# Altium project Projekat.PrjPcb
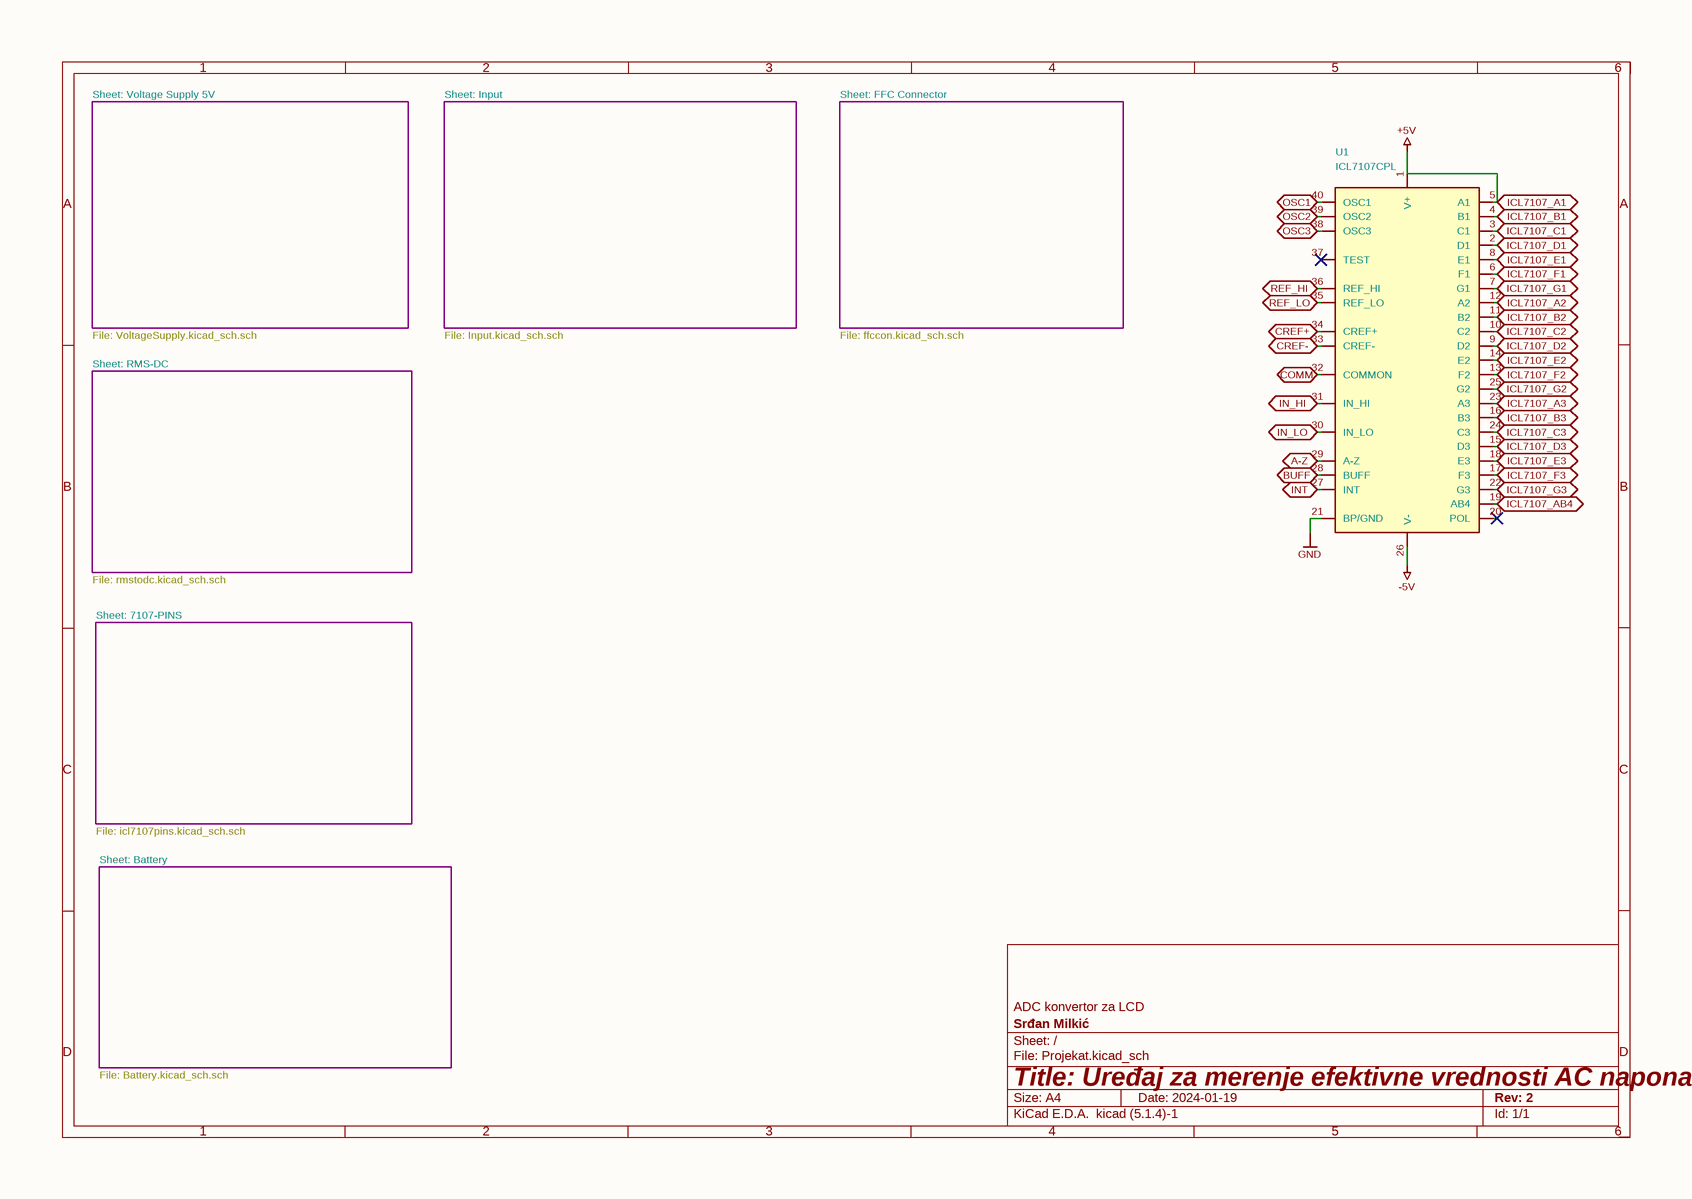
[diagram p0: Projekat.SchDoc]
7 sheets, 60 parts. Net scope: flat (ports and power ports of the same name join across sheets).
Board file: Projekat.PcbDoc
Sheets:
  Projekat.SchDoc
    Input = Input.SchDoc
    7107-PINS = icl7107pins.SchDoc
    Battery = Battery.SchDoc
    RMS-DC = rmstodc.SchDoc
    Voltage Supply 5V = VoltageSupply.SchDoc
    FFC Connector = ffccon.SchDoc

## Sheet Projekat.SchDoc
size 297 x 209 mm

### Parts
U1  ICL7107CPL  [DIP-40_W15.24mm]

### Sub-sheets
7107-PINS = icl7107pins.SchDoc: no entries
Battery = Battery.SchDoc: no entries
FFC Connector = ffccon.SchDoc: no entries
Input = Input.SchDoc: no entries
RMS-DC = rmstodc.SchDoc: no entries
Voltage Supply 5V = VoltageSupply.SchDoc: no entries

### Ports
A-Z (bidir), BUFF (bidir), COMM (bidir), CREF+ (bidir), CREF- (bidir), ICL7107_A1 (bidir), ICL7107_A2 (bidir), ICL7107_A3 (bidir), ICL7107_AB4 (bidir), ICL7107_B1 (bidir), ICL7107_B2 (bidir), ICL7107_B3 (bidir), ICL7107_C1 (bidir), ICL7107_C2 (bidir), ICL7107_C3 (bidir), ICL7107_D1 (bidir), ICL7107_D2 (bidir), ICL7107_D3 (bidir), ICL7107_E1 (bidir), ICL7107_E2 (bidir), ICL7107_E3 (bidir), ICL7107_F1 (bidir), ICL7107_F2 (bidir), ICL7107_F3 (bidir), ICL7107_G1 (bidir), ICL7107_G2 (bidir), ICL7107_G3 (bidir), IN_HI (bidir), IN_LO (bidir), INT (bidir), OSC1 (bidir), OSC2 (bidir), OSC3 (bidir), REF_HI (bidir), REF_LO (bidir)

### Nets
+5V: U1.1(V+) U1.5(A1) ; port ICL7107_A1
-5V: U1.21(BP/GND) U1.26(V-)  [also labelled GND]
A-Z: U1.29(A-Z) ; port A-Z
AD737_COM: U1.30(IN_LO) U1.32(COMMON) U1.35(REF_LO) ; port COMM, port REF_LO, port IN_LO
BUFF: U1.28(BUFF) ; port BUFF
CREF+: U1.34(CREF+) ; port CREF+
CREF-: U1.33(CREF-) ; port CREF-
ICL7107_A2: U1.12(A2) ; port ICL7107_A2
ICL7107_A3: U1.23(A3) ; port ICL7107_A3
ICL7107_AB4: U1.19(AB4) ; port ICL7107_AB4
ICL7107_B1: U1.4(B1) ; port ICL7107_B1
ICL7107_B2: U1.11(B2) ; port ICL7107_B2
ICL7107_B3: U1.16(B3) ; port ICL7107_B3
ICL7107_C1: U1.3(C1) ; port ICL7107_C1
ICL7107_C2: U1.10(C2) ; port ICL7107_C2
ICL7107_C3: U1.24(C3) ; port ICL7107_C3
ICL7107_D1: U1.2(D1) ; port ICL7107_D1
ICL7107_D2: U1.9(D2) ; port ICL7107_D2
ICL7107_D3: U1.15(D3) ; port ICL7107_D3
ICL7107_E1: U1.8(E1) ; port ICL7107_E1
ICL7107_E2: U1.14(E2) ; port ICL7107_E2
ICL7107_E3: U1.18(E3) ; port ICL7107_E3
ICL7107_F1: U1.6(F1) ; port ICL7107_F1
ICL7107_F2: U1.13(F2) ; port ICL7107_F2
ICL7107_F3: U1.17(F3) ; port ICL7107_F3
ICL7107_G1: U1.7(G1) ; port ICL7107_G1
ICL7107_G2: U1.25(G2) ; port ICL7107_G2
ICL7107_G3: U1.22(G3) ; port ICL7107_G3
IN_HI: U1.31(IN_HI) ; port IN_HI
INT: U1.27(INT) ; port INT
OSC1: U1.40(OSC1) ; port OSC1
OSC2: U1.39(OSC2) ; port OSC2
OSC3: U1.38(OSC3) ; port OSC3
REF_HI: U1.36(REF_HI) ; port REF_HI

Not connected (* = marked no-connect by the designer): U1 20(POL)* 37(TEST)*

### Notes on the sheet
- Sheet: Voltage Supply 5V
- Sheet: Input
- Sheet: FFC Connector
- File: VoltageSupply.kicad_sch.sch
- File: Input.kicad_sch.sch
- File: ffccon.kicad_sch.sch
- Sheet: RMS-DC
- File: rmstodc.kicad_sch.sch
- Sheet: 7107-PINS
- File: icl7107pins.kicad_sch.sch
- Sheet: Battery
- File: Battery.kicad_sch.sch
- 1
- 2
- 3
- 4
- 5
- 6
- A
- B
- C
- ADC konvertor za LCD
- D
- Title: Uređaj za merenje efektivne vrednosti AC napona
- File: Projekat.kicad_sch
- Sheet: /
- Srđan Milkić
- KiCad E.D.A.  kicad (5.1.4)-1
- Size: A4
- Date: 2024-01-19
- Rev: 2
- Id: 1/1

### Library data of the parts
U1 = ICL7107CPL: Value: ICL7107CPL; Footprint: Package_DIP:DIP-40_W15.24mm

## Sheet Input.SchDoc
size 297 x 209 mm
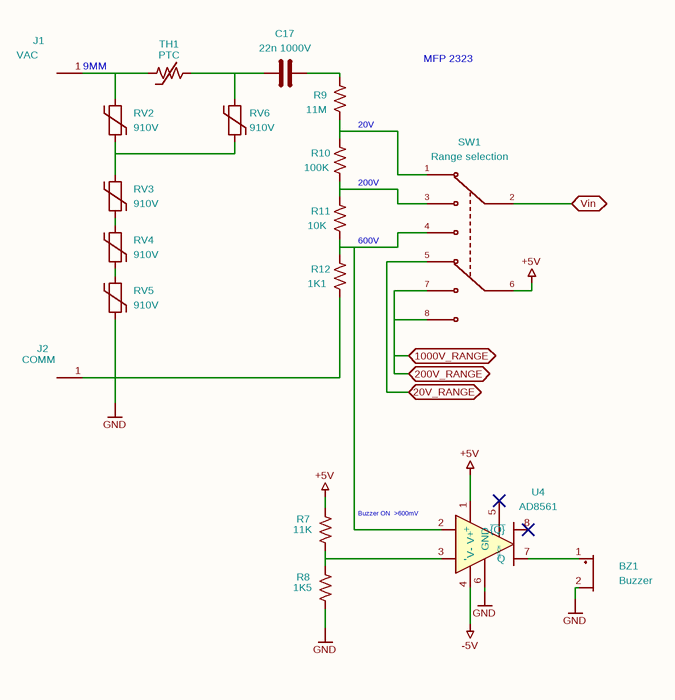
[diagram p1: Input.SchDoc]

### Parts
BZ1  Buzzer  [Buzzer_12x9.5RM7.6]
C17  22n 1000V  [C_Rect_L26.5mm_W11.5mm_P22.50mm_MKS4]
J1  VAC  [Banana_Jack_1Pin]
J2  COMM  [Banana_Jack_1Pin]
R7  11K  [R_1206_3216Metric]
R8  1K5  [R_1206_3216Metric]
R9  11M  [R_1210_3225Metric]
R10  100K  [R_1206_3216Metric]
R11  10K  [R_1206_3216Metric]
R12  1K1  [R_1206_3216Metric]
RV2  910V  [RV_Disc_D12mm_W3.9mm_P7.5mm]
RV3  910V  [RV_Disc_D12mm_W3.9mm_P7.5mm]
RV4  910V  [RV_Disc_D12mm_W3.9mm_P7.5mm]
RV5  910V  [RV_Disc_D12mm_W3.9mm_P7.5mm]
RV6  910V  [RV_Disc_D12mm_W3.9mm_P7.5mm]
SW1  Range selection  [SW_EG2310]
TH1  PTC  [R_Axial_DIN0414_L11.9mm_D4.5mm_P7.62mm_Vertical]
U4  AD8561  [DIP-8_W7.62mm]

### Ports
20V_RANGE (bidir), 200V_RANGE (bidir), 1000V_RANGE (bidir), Vin (bidir)

### Nets
+5V: R7.1 SW1.6 U4.1(V+)
-5V: BZ1.2(+) J2.1(Pin_1) R8.2 R12.2 RV5.2 U4.4(V-) U4.6(GND)  [also labelled GND]
20V_RANGE: SW1.5 ; port 20V_RANGE
1000V_RANGE: SW1.7 SW1.8 ; port 200V_RANGE, port 1000V_RANGE
Vin: SW1.2 ; port Vin
NetBZ1_1: BZ1.1(-) U4.7(Q)
NetC17_1: C17.1 RV6.1 TH1.2
NetC17_2: C17.2 R9.2
NetJ1_1: J1.1(Pin_1) RV2.1 TH1.1
NetR7_2: R7.2 R8.1 U4.3(-)
NetR9_1: R9.1 R10.1 SW1.1
NetR10_2: R10.2 R11.1 SW1.3
NetR11_2: R11.2 R12.1 SW1.4 U4.2(+)
NetRV2_2: RV2.2 RV3.1 RV6.2
NetRV3_2: RV3.2 RV4.1
NetRV4_2: RV4.2 RV5.1

Not connected (* = marked no-connect by the designer): U4 5(LATCH)* 8(~{{Q}})*

### Notes on the sheet
- 9MM
- MFP 2323
- 20V
- 200V
- 600V
- Buzzer ON  >600mV
- 1
- 2
- 3
- 4
- 5
- 6
- A
- B
- C
- D
- Title: Uređaj za merenje efektivne vrednosti AC napona
- File: Input.kicad_sch
- Sheet: /
- Srđan Milkić
- KiCad E.D.A.  kicad (5.1.4)-1
- Size: A4
- Date: 2024-01-19
- Rev: 2
- Id: 1/1

### Library data of the parts
C17 = C: Value: 22n 1000V; Footprint: Capacitor_THT:C_Rect_L26.5mm_W11.5mm_P22.50mm_MKS4
J1 J2 = Conn_01x01_Female: Footprint: Connector:Banana_Jack_1Pin
  J1: Value: VAC
  J2: Value: COMM
R7-R12 = R_US
  R7: Value: 11K; Footprint: Resistor_SMD:R_1206_3216Metric
  R8: Value: 1K5; Footprint: Resistor_SMD:R_1206_3216Metric
  R9: Value: 11M; Footprint: Resistor_SMD:R_1210_3225Metric
  R10: Value: 100K; Footprint: Resistor_SMD:R_1206_3216Metric
  R11: Value: 10K; Footprint: Resistor_SMD:R_1206_3216Metric
  R12: Value: 1K1; Footprint: Resistor_SMD:R_1206_3216Metric
RV2 = Varistor_1: Value: 910V; Footprint: Varistor:RV_Disc_D12mm_W3.9mm_P7.5mm
RV3 = Varistor_2: Value: 910V; Footprint: Varistor:RV_Disc_D12mm_W3.9mm_P7.5mm
RV4 = Varistor_3: Value: 910V; Footprint: Varistor:RV_Disc_D12mm_W3.9mm_P7.5mm
RV5 = Varistor: Value: 910V; Footprint: Varistor:RV_Disc_D12mm_W3.9mm_P7.5mm
RV6 = Varistor_4: Value: 910V; Footprint: Varistor:RV_Disc_D12mm_W3.9mm_P7.5mm
SW1 = EG2310: MF: E-Switch; Description: \nSlide Switch DP3T Through Hole, Right Angle\n; MAXIMUM_PACKAGE_HEIGHT: 4.7mm; Package: None; Price: None; Check_prices: https://www.snapeda.com/parts/EG2310/E-Switch/view-part/?ref=eda; STANDARD: Manufacturer Recommendations; PARTREV: -; SnapEDA_Link: https://www.snapeda.com/parts/EG2310/E-Switch/view-part/?ref=snap; MP: EG2310; Purchase-URL: https://www.snapeda.com/api/url_track_click_mouser/?unipart_id=396456&manufacturer=E-Switch&part_name=EG2310&search_term=None; MANUFACTURER: E-Switch; Availability: In Stock; SNAPEDA_PN: EG2310; Value: Range selection; Footprint: priums_lib:SW_EG2310
TH1 = Thermistor_US: Value: PTC; Footprint: Resistor_THT:R_Axial_DIN0414_L11.9mm_D4.5mm_P7.62mm_Vertical
BZ1 = Buzzer: Value: Buzzer; Footprint: Buzzer_Beeper:Buzzer_12x9.5RM7.6
U4 = AD8561: Value: AD8561; Footprint: Package_DIP:DIP-8_W7.62mm

## Sheet icl7107pins.SchDoc
size 297 x 209 mm
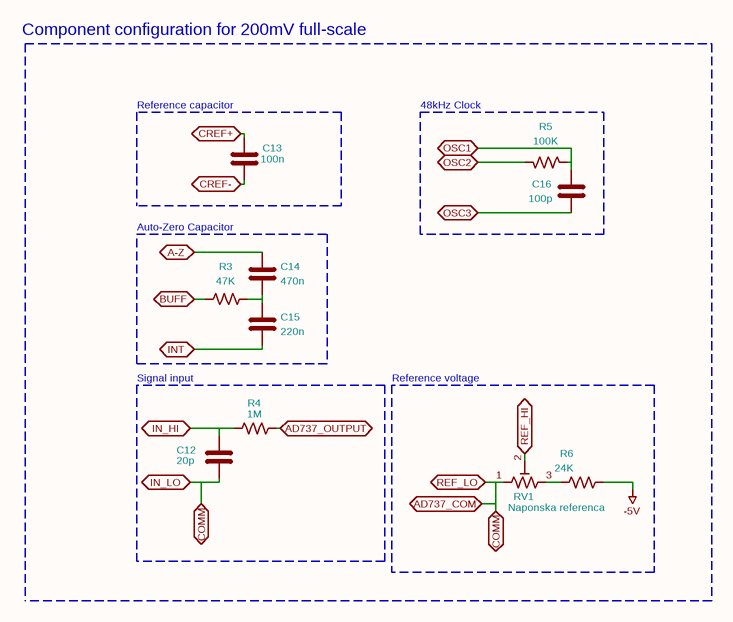
[diagram p2: icl7107pins.SchDoc]

### Parts
C12  20p  [C_1210_3225Metric]
C13  100n  [C_1210_3225Metric]
C14  470n  [C_1206_3216Metric]
C15  220n  [C_1206_3216Metric]
C16  100p  [C_1206_3216Metric]
R3  47K  [R_1206_3216Metric]
R4  1M  [R_1812_4532Metric]
R5  100K  [R_1206_3216Metric]
R6  24K  [R_1206_3216Metric]
RV1  Naponska referenca  [Potentiometer_Bourns_3266W_Vertical]

### Blocks framed on the sheet
Reference capacitor /: C13
48kHz Clock: C16 R5
Auto-Zero Capacitor /: C14 C15 R3
Signal input: C12 R4
Reference voltage: R6 RV1

### Ports
A-Z (bidir), AD737_COM (bidir), AD737_OUTPUT (bidir), BUFF (bidir), COMM (bidir), CREF+ (bidir), CREF- (bidir), IN_HI (bidir), IN_LO (bidir), INT (bidir), OSC1 (bidir), OSC2 (bidir), OSC3 (bidir), REF_HI (bidir), REF_LO (bidir)

### Nets
-5V: R6.1
A-Z: C14.2 ; port A-Z
AD737_COM: C12.2 RV1.1 ; port AD737_COM, port REF_LO, port COMM, port IN_LO
AD737_OUTPUT: R4.2 ; port AD737_OUTPUT
BUFF: R3.1 ; port BUFF
CREF+: C13.1 ; port CREF+
CREF-: C13.2 ; port CREF-
IN_HI: C12.1 R4.1 ; port IN_HI
INT: C15.1 ; port INT
OSC1: C16.1 R5.1 ; port OSC1
OSC2: R5.2 ; port OSC2
OSC3: C16.2 ; port OSC3
REF_HI: RV1.2 ; port REF_HI
NetC14_1: C14.1 C15.2 R3.2
NetR6_2: R6.2 RV1.3

### Notes on the sheet
- Component configuration for 200mV full-scale
- 1
- 2
- 3
- 4
- 5
- 6
- A
- B
- C
- Konfiguracija ICL7107 ADC konvertora
- D
- Title: Uređaj za merenje efektivne vrednosti AC napona
- File: icl7107pins.kicad_sch
- Sheet: /
- Srđan Milkić
- KiCad E.D.A.  kicad (5.1.4)-1
- Size: A4
- Date: 2024-01-19
- Rev: 2
- Id: 1/1

### Library data of the parts
C12-C16 = C
  C12: Value: 20p; Footprint: Capacitor_SMD:C_1210_3225Metric
  C13: Value: 100n; Footprint: Capacitor_SMD:C_1210_3225Metric
  C14: Value: 470n; Footprint: Capacitor_SMD:C_1206_3216Metric
  C15: Value: 220n; Footprint: Capacitor_SMD:C_1206_3216Metric
  C16: Value: 100p; Footprint: Capacitor_SMD:C_1206_3216Metric
R3-R6 = R_US
  R3: Value: 47K; Footprint: Resistor_SMD:R_1206_3216Metric
  R4: Value: 1M; Footprint: Resistor_SMD:R_1812_4532Metric
  R5: Value: 100K; Footprint: Resistor_SMD:R_1206_3216Metric
  R6: Value: 24K; Footprint: Resistor_SMD:R_1206_3216Metric
RV1 = R_Potentiometer_Trim_US: Value: Naponska referenca; Footprint: Potentiometer_THT:Potentiometer_Bourns_3266W_Vertical

## Sheet Battery.SchDoc
size 297 x 209 mm
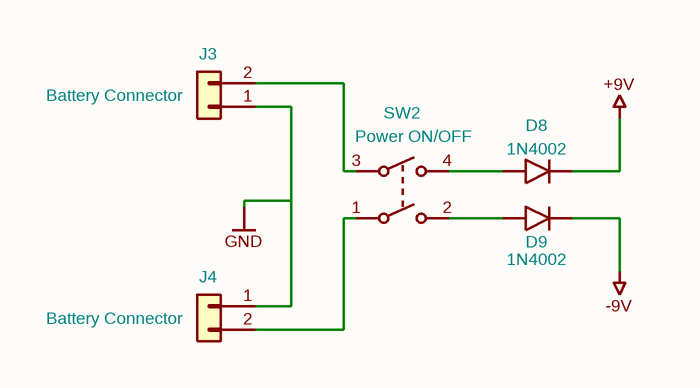
[diagram p3: Battery.SchDoc]

### Parts
D8  1N4002  [D_DO-41_SOD81_P10.16mm_Horizontal]
D9  1N4002  [D_DO-41_SOD81_P10.16mm_Horizontal]
J3  Battery Connector  [PinHeader_1x02_P2.54mm_Vertical]
J4  Battery Connector  [PinHeader_1x02_P2.54mm_Vertical]
SW2  Power ON/OFF  [SW_CuK_JS202011AQN_DPDT_Angled]

### Nets
+9V: D8.1(K)
-9V: D9.1(K)
GND: J3.1(Pin_1) J4.1(Pin_1)  [project net -5V]
NetD8_2: D8.2(A) SW2.4
NetD9_2: D9.2(A) SW2.2
NetJ3_2: J3.2(Pin_2) SW2.3
NetJ4_2: J4.2 SW2.1

### Notes on the sheet
- 1
- 2
- 3
- 4
- 5
- 6
- A
- B
- C
- Baterijsko napajanje
- D
- Title: Uređaj za merenje efektivne vrednosti AC napona
- File: Battery.kicad_sch
- Sheet: /
- Srđan Milkić
- KiCad E.D.A.  kicad (5.1.4)-1
- Size: A4
- Date: 2024-01-19
- Rev: 2
- Id: 1/1

### Library data of the parts
J3 = Conn_01x02_1: Value: Battery Connector; Footprint: Connector_PinHeader_2.54mm:PinHeader_1x02_P2.54mm_Vertical
J4 = Conn_01x02: Value: Battery Connector; Footprint: Connector_PinHeader_2.54mm:PinHeader_1x02_P2.54mm_Vertical
SW2 = SW_DPST: Value: Power ON/OFF; Footprint: Button_Switch_THT:SW_CuK_JS202011AQN_DPDT_Angled
D8 D9 = 1N4002: Value: 1N4002; Footprint: Diode_THT:D_DO-41_SOD81_P10.16mm_Horizontal

## Sheet rmstodc.SchDoc
size 297 x 209 mm
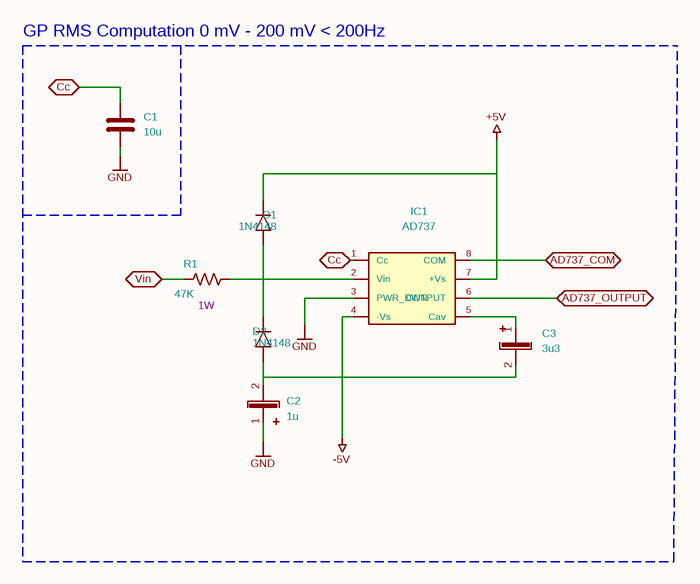
[diagram p4: rmstodc.SchDoc]

### Parts
C1  10u  [C_1206_3216Metric]
C2  1u  [C_1210_3225Metric]
C3  3u3  [C_1210_3225Metric]
D1  1N4148  [D_DO-35_SOD27_P7.62mm_Horizontal]
D2  1N4148  [D_DO-35_SOD27_P7.62mm_Horizontal]
IC1  AD737  [DIP-8_W10.16mm]
R1  Power Rating: 1W  [R_1206_3216Metric]  (hidden comment: 47K)

### Blocks framed on the sheet
GP RMS Computation / 0 mV - 200 mV / < 200Hz: C1-C3 D1 D2 IC1 R1

### Ports
AD737_COM (bidir), AD737_OUTPUT (bidir), Cc (bidir), Vin (bidir)

### Nets
+5V: D1.1(K) IC1.7(+Vs)
-5V: C1.2 C2.1 C2.2 C3.2 D2.2(A) IC1.3(PWR_DWN) IC1.4(-Vs)  [also labelled GND]
AD737_COM: IC1.8(COM) ; port AD737_COM
AD737_OUTPUT: IC1.6(OUTPUT) ; port AD737_OUTPUT
Cc: C1.1 IC1.1(Cc) ; port Cc
Vin: R1.2 ; port Vin
NetC3_1: C3.1 IC1.5(Cav)
NetD1_2: D1.2(A) D2.1(K) IC1.2(Vin) R1.1

### Notes on the sheet
- 1
- 2
- 3
- 4
- 5
- 6
- A
- B
- C
- AC - DC konvertor
- D
- Title: Uređaj za merenje efektivne vrednosti AC napona
- File: rmstodc.kicad_sch
- Sheet: /
- Srđan Milkić
- KiCad E.D.A.  kicad (5.1.4)-1
- Size: A4
- Date: 2024-01-19
- Rev: 2
- Id: 1/1

### Library data of the parts
C1 = C: Value: 10u; Footprint: Capacitor_SMD:C_1206_3216Metric
C2 = Cap_pol: Value: 1u; Footprint: Capacitor_SMD:C_1210_3225Metric
C3 = Cap_pol_1: Value: 3u3; Footprint: Capacitor_SMD:C_1210_3225Metric
D1 = 1N4148_1: Value: 1N4148; Footprint: Diode_THT:D_DO-35_SOD27_P7.62mm_Horizontal
R1 = R_US: Value: 47K; Footprint: Resistor_SMD:R_1206_3216Metric
D2 = 1N4148: Value: 1N4148; Footprint: Diode_THT:D_DO-35_SOD27_P7.62mm_Horizontal
IC1 = AD737: Value: AD737; Footprint: Package_DIP:DIP-8_W10.16mm

## Sheet VoltageSupply.SchDoc
size 297 x 209 mm
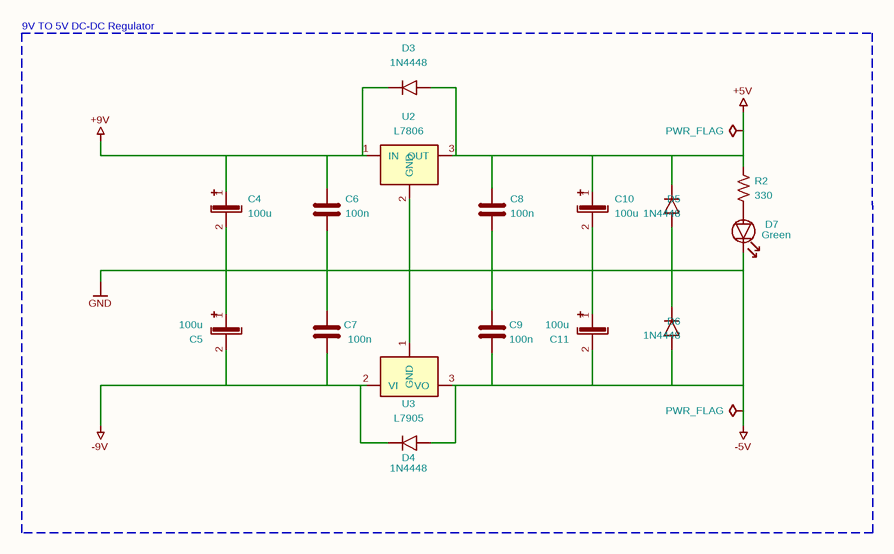
[diagram p5: VoltageSupply.SchDoc]

### Parts
#FLG01  PWR_FLAG  (graphical)
#FLG02  PWR_FLAG  (graphical)
C4  100u  [C_1210_3225Metric]
C5  100u  [C_1210_3225Metric]
C6  100n  [C_1210_3225Metric]
C7  100n  [C_1210_3225Metric]
C8  100n  [C_1210_3225Metric]
C9  100n  [C_1210_3225Metric]
C10  100u  [C_1206_3216Metric]
C11  100u  [C_1206_3216Metric]
D3  1N4448  [D_DO-35_SOD27_P7.62mm_Horizontal]
D4  1N4448  [D_DO-35_SOD27_P7.62mm_Horizontal]
D5  1N4448  [D_DO-35_SOD27_P7.62mm_Horizontal]
D6  1N4448  [D_DO-35_SOD27_P7.62mm_Horizontal]
D7  Green  [LED_D5.0mm_Horizontal_O6.35mm_Z15.0mm]
R2  330  [R_1206_3216Metric]
U2  L7806  [TO-220-3_Horizontal_TabDown]
U3  L7905  [TO-220-3_Horizontal_TabDown]

### Blocks framed on the sheet
9V TO 5V DC-DC Regulator /: #FLG01 #FLG02 C4-C11 D3-D7 R2 U2 U3

### Nets
+5V: #FLG01.1(pwr) C8.1 C10.1 D3.2(A) D5.1(K) R2.1 U2.3(OUT)
+9V: C4.1 C6.1 D3.1(K) U2.1(IN)
-5V: #FLG02.1(pwr) C4.2 C5.1 C6.2 C7.2 C8.2 C9.1 C9.2 C10.2 C11.1 C11.2 D4.2(A) D5.2(A) D6.1(K) D6.2(A) D7.1(K) U2.2(GND) U3.1(GND) U3.3(VO)  [also labelled GND]
-9V: C5.2 C7.1 D4.1(K) U3.2(VI)
NetD7_2: D7.2(A) R2.2

### Notes on the sheet
- 1
- 2
- 3
- 4
- 5
- 6
- A
- B
- C
- Bipolarno napajanje za 5V
- D
- Title: Uređaj za merenje efektivne vrednosti AC napona
- File: VoltageSupply.kicad_sch
- Sheet: /
- Srđan Milkić
- KiCad E.D.A.  kicad (5.1.4)-1
- Size: A4
- Date: 2024-01-19
- Rev: 2
- Id: 1/1

### Library data of the parts
C4 C5 = Cap_pol: Value: 100u; Footprint: Capacitor_SMD:C_1210_3225Metric
C6-C9 = C: Value: 100n; Footprint: Capacitor_SMD:C_1210_3225Metric
C10 = Cap_pol_2: Value: 100u; Footprint: Capacitor_SMD:C_1206_3216Metric
C11 = Cap_pol_1: Value: 100u; Footprint: Capacitor_SMD:C_1206_3216Metric
D7 = LED: Value: Green; Footprint: LED_THT:LED_D5.0mm_Horizontal_O6.35mm_Z15.0mm
R2 = R_US: Value: 330; Footprint: Resistor_SMD:R_1206_3216Metric
#FLG01 #FLG02 = PWR_FLAG: Value: PWR_FLAG
D3-D6 = 1N4448: Value: 1N4448; Footprint: Diode_THT:D_DO-35_SOD27_P7.62mm_Horizontal
U2 = L7806: Value: L7806; Footprint: Package_TO_SOT_THT:TO-220-3_Horizontal_TabDown
U3 = L7905: Value: L7905; Footprint: Package_TO_SOT_THT:TO-220-3_Horizontal_TabDown

## Sheet ffccon.SchDoc
size 297 x 209 mm
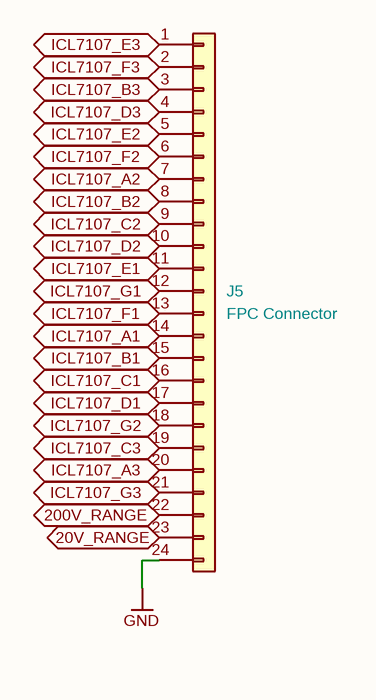
[diagram p6: ffccon.SchDoc]

### Parts
J5  FPC Connector  [FPC_24]

### Ports
20V_RANGE (bidir), 200V_RANGE (bidir), ICL7107_A1 (bidir), ICL7107_A2 (bidir), ICL7107_A3 (bidir), ICL7107_B1 (bidir), ICL7107_B2 (bidir), ICL7107_B3 (bidir), ICL7107_C1 (bidir), ICL7107_C2 (bidir), ICL7107_C3 (bidir), ICL7107_D1 (bidir), ICL7107_D2 (bidir), ICL7107_D3 (bidir), ICL7107_E1 (bidir), ICL7107_E2 (bidir), ICL7107_E3 (bidir), ICL7107_F1 (bidir), ICL7107_F2 (bidir), ICL7107_F3 (bidir), ICL7107_G1 (bidir), ICL7107_G2 (bidir), ICL7107_G3 (bidir)

### Nets
+5V: J5.14(Pin_14) ; port ICL7107_A1
GND: J5.24(Pin_24)  [project net -5V]
20V_RANGE: J5.23(Pin_23) ; port 20V_RANGE
1000V_RANGE: J5.22(Pin_22) ; port 200V_RANGE
ICL7107_A2: J5.7(Pin_7) ; port ICL7107_A2
ICL7107_A3: J5.20(Pin_20) ; port ICL7107_A3
ICL7107_B1: J5.15(Pin_15) ; port ICL7107_B1
ICL7107_B2: J5.8(Pin_8) ; port ICL7107_B2
ICL7107_B3: J5.3(Pin_3) ; port ICL7107_B3
ICL7107_C1: J5.16(Pin_16) ; port ICL7107_C1
ICL7107_C2: J5.9(Pin_9) ; port ICL7107_C2
ICL7107_C3: J5.19(Pin_19) ; port ICL7107_C3
ICL7107_D1: J5.17(Pin_17) ; port ICL7107_D1
ICL7107_D2: J5.10(Pin_10) ; port ICL7107_D2
ICL7107_D3: J5.4(Pin_4) ; port ICL7107_D3
ICL7107_E1: J5.11(Pin_11) ; port ICL7107_E1
ICL7107_E2: J5.5(Pin_5) ; port ICL7107_E2
ICL7107_E3: J5.1(Pin_1) ; port ICL7107_E3
ICL7107_F1: J5.13(Pin_13) ; port ICL7107_F1
ICL7107_F2: J5.6(Pin_6) ; port ICL7107_F2
ICL7107_F3: J5.2(Pin_2) ; port ICL7107_F3
ICL7107_G1: J5.12(Pin_12) ; port ICL7107_G1
ICL7107_G2: J5.18(Pin_18) ; port ICL7107_G2
ICL7107_G3: J5.21(Pin_21) ; port ICL7107_G3

### Notes on the sheet
- 1
- 2
- 3
- 4
- 5
- 6
- A
- B
- C
- Konektor za FFC traku
- D
- Title: Uređaj za merenje efektivne vrednosti AC napona
- File: ffccon.kicad_sch
- Sheet: /
- Srđan Milkić
- KiCad E.D.A.  kicad (5.1.4)-1
- Size: A4
- Date: 2024-01-19
- Rev: 2
- Id: 1/1

### Library data of the parts
J5 = Conn_01x24: Value: FPC Connector; Footprint: priums_lib:FPC_24

## Nets that join several sheets
+5V: Projekat (U1.1 U1.5), Input (R7.1 SW1.6 U4.1), rmstodc (D1.1 IC1.7), VoltageSupply (7 pins), ffccon (J5.14)
+9V: Battery (D8.1), VoltageSupply (C4.1 C6.1 D3.1 U2.1)
-5V: Projekat (U1.21 U1.26), Input (7 pins), icl7107pins (R6.1), Battery (J3.1 J4.1), rmstodc (7 pins), VoltageSupply (19 pins), ffccon (J5.24)
-9V: Battery (D9.1), VoltageSupply (C5.2 C7.1 D4.1 U3.2)
20V_RANGE: Input (SW1.5), ffccon (J5.23)
1000V_RANGE: Input (SW1.7 SW1.8), ffccon (J5.22)
A-Z: Projekat (U1.29), icl7107pins (C14.2)
AD737_COM: Projekat (U1.30 U1.32 U1.35), icl7107pins (C12.2 RV1.1), rmstodc (IC1.8)
AD737_OUTPUT: icl7107pins (R4.2), rmstodc (IC1.6)
BUFF: Projekat (U1.28), icl7107pins (R3.1)
CREF+: Projekat (U1.34), icl7107pins (C13.1)
CREF-: Projekat (U1.33), icl7107pins (C13.2)
ICL7107_A2: Projekat (U1.12), ffccon (J5.7)
ICL7107_A3: Projekat (U1.23), ffccon (J5.20)
ICL7107_B1: Projekat (U1.4), ffccon (J5.15)
ICL7107_B2: Projekat (U1.11), ffccon (J5.8)
ICL7107_B3: Projekat (U1.16), ffccon (J5.3)
ICL7107_C1: Projekat (U1.3), ffccon (J5.16)
ICL7107_C2: Projekat (U1.10), ffccon (J5.9)
ICL7107_C3: Projekat (U1.24), ffccon (J5.19)
ICL7107_D1: Projekat (U1.2), ffccon (J5.17)
ICL7107_D2: Projekat (U1.9), ffccon (J5.10)
ICL7107_D3: Projekat (U1.15), ffccon (J5.4)
ICL7107_E1: Projekat (U1.8), ffccon (J5.11)
ICL7107_E2: Projekat (U1.14), ffccon (J5.5)
ICL7107_E3: Projekat (U1.18), ffccon (J5.1)
ICL7107_F1: Projekat (U1.6), ffccon (J5.13)
ICL7107_F2: Projekat (U1.13), ffccon (J5.6)
ICL7107_F3: Projekat (U1.17), ffccon (J5.2)
ICL7107_G1: Projekat (U1.7), ffccon (J5.12)
ICL7107_G2: Projekat (U1.25), ffccon (J5.18)
ICL7107_G3: Projekat (U1.22), ffccon (J5.21)
IN_HI: Projekat (U1.31), icl7107pins (C12.1 R4.1)
INT: Projekat (U1.27), icl7107pins (C15.1)
OSC1: Projekat (U1.40), icl7107pins (C16.1 R5.1)
OSC2: Projekat (U1.39), icl7107pins (R5.2)
OSC3: Projekat (U1.38), icl7107pins (C16.2)
REF_HI: Projekat (U1.36), icl7107pins (RV1.2)
Vin: Input (SW1.2), rmstodc (R1.2)